# EAGLE design DASH (EAGLE 6.5.0)
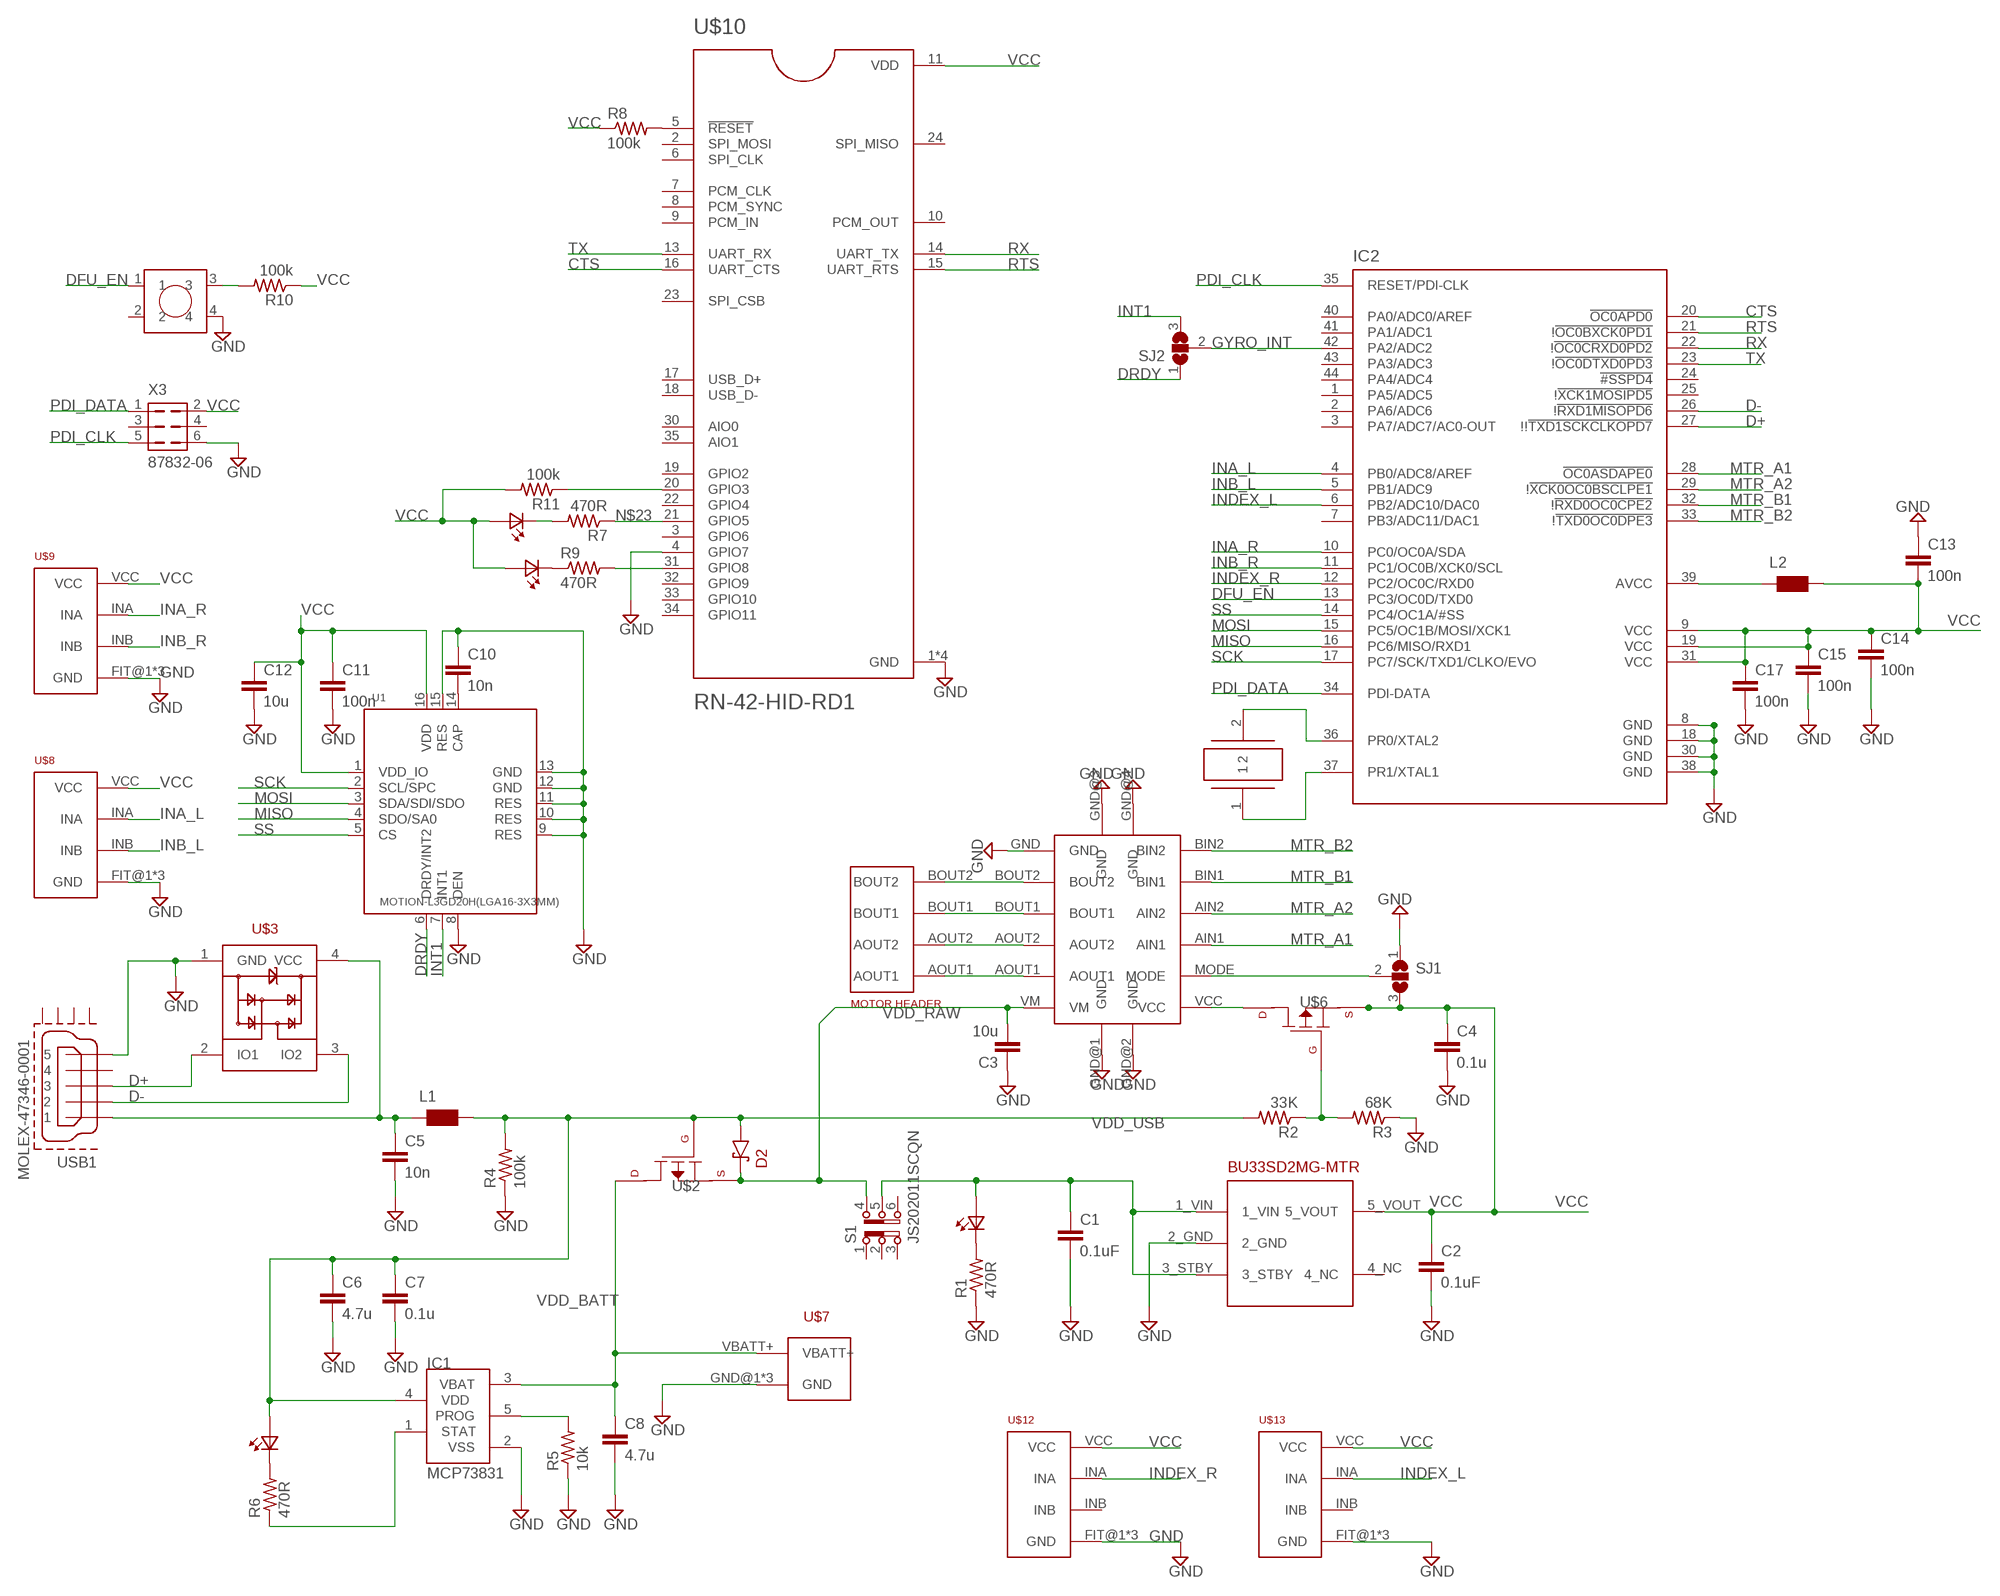
[diagram p0: schematic, sheet 1]

## Parts
C1  0.1uF  0.1UF-25V(+80/-20%)(0603)  [0603-CAP]
C2  0.1uF  0.1UF-25V(+80/-20%)(0603)  [0603-CAP]
C3  10u  C-EUC0805  [C0805]
C4  0.1u  C-EUC0603  [C0603]
C5  10n  C-EUC0603  [C0603]
C6  4.7u  C-EUC0603  [C0603]
C7  0.1u  C-EUC0603  [C0603]
C8  4.7u  C-EUC0603  [C0603]
C10  10n  C-EUC0603  [C0603]
C11  100n  C-EUC0603  [C0603]
C12  10u  C-EUC0805  [C0805]
C13  100n  C-EUC0603  [C0603]
C14  100n  C-EUC0603  [C0603]
C15  100n  C-EUC0603  [C0603]
C17  100n  C-EUC0603  [C0603]
D1  LTST-C190KRKT  [0603]
D2  SCHOTTKY_DIODE_0805  [SCHOTTKY_DIODE_0805]
D3  LTST-C190KRKT  [0603]
D5  LTST-C190KRKT  [0603]
D6  LTST-C190KRKT  [0603]
IC1  MCP73831  [SOT23-5L]
IC2  AT-XMEGA-XXA4-AU  [QFP80P1200X1200X120-44N]
L1  WE-CBF_0603  [0603]
L2  WE-CBF_0603  [0603]
R1  470R  R-US_R0603  [R0603]
R2  33K  R-US_R0603  [R0603]
R3  68K  R-US_R0603  [R0603]
R4  100k  R-US_R0603  [R0603]
R5  10k  R-US_R0603  [R0603]
R6  470R  R-US_R0603  [R0603]
R7  470R  R-US_R0603  [R0603]
R8  100k  R-US_R0603  [R0603]
R9  470R  R-US_R0603  [R0603]
R10  100k  R-US_R0603  [R0603]
R11  100k  R-US_R0603  [R0603]
S1  JS202011SCQN  [JS202011SCQN]
SJ1  SJ2W  [SJ_2]
SJ2  SJ2W  [SJ_2]
U1  MOTION-L3GD20H(LGA16-3X3MM)  [LGA16-0.5-3X3MM]
U$1  LDO_BU33SD2-MSURFACE_MOUNT  [SSOP5]
U$2  P-FETSMD  [SOT-323]
U$3  PRTR5V0U2X  [SOT143B]
U$4  DRV8835  [DRV8835]
U$5  SMB04-SRSS-TBSMD  [SM04B-SRSS-TB]
U$6  P-FETSMD  [SOT-323]
U$7  SM02B-SRSS  [SM02B-SRSS]
U$8  LEFT_ENCODER  [SM04B-SRSS-TB]
U$9  LEFT_ENCODER  [SM04B-SRSS-TB]
U$10  RN-42-HID-RD1  [MICROCHIP_RN-42-HID-RD1]
U$11  PUSHBUTTON  [PUSHBUTTON]
U$12  LEFT_ENCODER  [SM04B-SRSS-TB]
U$13  LEFT_ENCODER  [SM04B-SRSS-TB]
U$14  FC-12M_32.7  [FC-12M_32.7]
USB1  MOLEX-47346-0001  [MOLEX-47364-0001]
X3  87832-06  [87832-06]

## Nets
CTS: IC2.20(!OC0APD0) U$10.16(UART_CTS)
D+: IC2.27(!!!TXD1SCKCLKOPD7) U$3.2(IO1) USB1.3
D-: IC2.26(!!RXD1MISOPD6) U$3.3(IO2) USB1.2
DFU_EN: IC2.13(PC3/OC0D/TXD0) U$11.1
DRDY: SJ2.1 U1.6(DRDY/INT2)
GND: C1.2 C2.2 C3.1 C4.2 C5.2 C6.2 C7.2 C8.2 C10.1 C11.2 C12.2 C13.1 C14.2 C15.2 C17.2 IC1.2(VSS) IC2.8(GND) IC2.18(GND) IC2.30(GND) IC2.38(GND) R1.1 R3.1 R4.1 R5.1 SJ1.1 U1.8(DEN) U1.9(RES) U1.10(RES) U1.11(RES) U1.12(GND) U1.13(GND) U1.15(RES) U$1.2_GND U$3.1(GND) U$4.GND U$4.GND@1(GND) U$4.GND@2(GND) U$4.GND@3(GND) U$4.GND@4(GND) U$7.GND@1(GND) U$7.GND@2(GND) U$7.VBATT-(GND) U$8.FIT@1(GND) U$8.FIT@2(GND) U$8.GND U$9.FIT@1(GND) U$9.FIT@2(GND) U$9.GND U$10.1(GND) U$10.4(GPIO7) U$10.12(GND) U$10.28(GND) U$10.29(GND) U$11.4 U$12.FIT@1(GND) U$12.FIT@2(GND) U$12.GND U$13.FIT@1(GND) U$13.FIT@2(GND) U$13.GND USB1.5 X3.6
GYRO_INT: IC2.42(PA2/ADC2) SJ2.2
INA_L: IC2.4(PB0/ADC8/AREF) U$8.INA
INA_R: IC2.10(PC0/OC0A/SDA) U$9.INA
INB_L: IC2.5(PB1/ADC9) U$8.INB
INB_R: IC2.11(PC1/OC0B/XCK0/SCL) U$9.INB
INDEX_L: IC2.6(PB2/ADC10/DAC0) U$13.INA
INDEX_R: IC2.12(PC2/OC0C/RXD0) U$12.INA
INT1: SJ2.3 U1.7(INT1)
MISO: IC2.16(PC6/MISO/RXD1) U1.4(SDO/SA0)
MOSI: IC2.15(PC5/OC1B/MOSI/XCK1) U1.3(SDA/SDI/SDO)
MTR_A1: IC2.28(!OC0ASDAPE0) U$4.AIN1
MTR_A2: IC2.29(!!XCK0OC0BSCLPE1) U$4.AIN2
MTR_B1: IC2.32(!!RXD0OC0CPE2) U$4.BIN1
MTR_B2: IC2.33(!!TXD0OC0DPE3) U$4.BIN2
N$1: C1.1 D1.2(A2) S1.5 U$1.1_VIN U$1.3_STBY
N$2: D1.1(K2) R1.2
N$3: R10.2 U$11.3
N$4: U$4.AOUT1 U$5.AOUT1
N$5: C10.2 U1.14(CAP)
N$6: U$4.AOUT2 U$5.AOUT2
N$7: U$4.BOUT1 U$5.BOUT1
N$8: U$4.BOUT2 U$5.BOUT2
N$9: U$4.VCC U$6.3_DRAIN
N$10: R2.1 R3.2 U$6.1_GATE
N$11: SJ1.2 U$4.MODE
N$12: C5.1 L1.1 U$3.4(VCC) USB1.1
N$13: D3.1(K2) R6.2
N$14: IC1.5(PROG) R5.2
N$15: IC1.1(STAT) R6.1
N$16: D5.1(K2) R7.2
N$17: D6.1(K2) R9.1
N$18: IC2.36(PR0/XTAL2) U$14.2
N$19: IC2.37(PR1/XTAL1) U$14.1
N$20: IC2.39(AVCC) L2.1
N$21: R9.2 U$10.31(GPIO8)
N$22: R8.2 U$10.5(!RESET)
N$23: R7.1 U$10.21(GPIO5)
N$24: R11.1 U$10.20(GPIO3)
PDI_CLK: IC2.35(RESET/PDI-CLK) X3.5
PDI_DATA: IC2.34(PDI-DATA) X3.1
RTS: IC2.21(!!OC0BXCK0PD1) U$10.15(UART_RTS)
RX: IC2.22(!!OC0CRXD0PD2) U$10.14(UART_TX)
SCK: IC2.17(PC7/SCK/TXD1/CLKO/EVO) U1.2(SCL/SPC)
SS: IC2.14(PC4/OC1A/#SS) U1.5(CS)
TX: IC2.23(!!OC0DTXD0PD3) U$10.13(UART_RX)
VCC: C2.1 C4.1 C11.1 C12.1 C13.2 C14.1 C15.1 C17.1 D5.2(A2) D6.2(A2) IC2.9(VCC) IC2.19(VCC) IC2.31(VCC) L2.2 R8.1 R10.1 R11.2 SJ1.3 U1.1(VDD_IO) U1.16(VDD) U$1.5_VOUT U$6.2_SOURCE U$8.VCC U$9.VCC U$10.11(VDD) U$12.VCC U$13.VCC X3.2
VDD_BATT: C8.1 IC1.3(VBAT) U$2.3_DRAIN U$7.VBATT+
VDD_RAW: C3.2 D2.1_CATHODE S1.4 U$2.2_SOURCE U$4.VM
VDD_USB: C6.1 C7.1 D2.2_ANODE D3.2(A2) IC1.4(VDD) L1.2 R2.2 R4.2 U$2.1_GATE
Unconnected: IC2.1(PA5/ADC5) IC2.2(PA6/ADC6) IC2.3(PA7/ADC7/AC0-OUT) IC2.7(PB3/ADC11/DAC1) IC2.24(!#SSPD4) IC2.25(!!XCK1MOSIPD5) IC2.40(PA0/ADC0/AREF) IC2.41(PA1/ADC1) IC2.43(PA3/ADC3) IC2.44(PA4/ADC4) S1.1 S1.2 S1.3 S1.6 U$1.4_NC U$10.2(SPI_MOSI) U$10.3(GPIO6) U$10.6(SPI_CLK) U$10.7(PCM_CLK) U$10.8(PCM_SYNC) U$10.9(PCM_IN) U$10.10(PCM_OUT) U$10.17(USB_D+) U$10.18(USB_D-) U$10.19(GPIO2) U$10.22(GPIO4) U$10.23(SPI_CSB) U$10.24(SPI_MISO) U$10.30(AIO0) U$10.32(GPIO9) U$10.33(GPIO10) U$10.34(GPIO11) U$10.35(AIO1) U$11.2 U$12.INB U$13.INB USB1.4 USB1.GND1 USB1.GND2 USB1.GND3 USB1.GND4 X3.3 X3.4

## Power pins joined to a net without a drawn wire
GND: U$4.GND@5(GND)

## Library data of the parts
C1 C2 = SparkFun-Capacitors:0.1UF-25V(+80/-20%)(0603): CAP-00810 Ceramic Standard decoupling cap; PROD_ID: CAP-00810
C3-C8 = rcl:C-EU: CAPACITOR, European symbol
C10-C15 C17 = resistor:C-EU: CAPACITOR, European symbol
D1 D3 D5 D6 = LTST-C190KRKT:LTST-C190KRKT: http://octopart.com/ltst-c190krkt-lite-on-549893
D2 = SCHOTTKY_DIODE_0805:SCHOTTKY_DIODE_0805
IC1 = microchip-update-2:MCP73831: Miniature Single-Cell, Fully Integrated Li-Ion, Li-Polymer Charge Management Controllers
IC2 = xmega-a4:AT-XMEGA-XXA4-AU: ATxMega a4 Serie
L1 L2 = wuerth-elektronik:WE-CBF: SMD EMI Suppression Ferrite Beads - excellent anti-EMI properties - low DCR - impedances till 3000 ohms - rated current up to 6 A
R1 R4-R11 = rcl:R-US_: RESISTOR, American symbol
R2 R3 = resistor:R-US_: RESISTOR, American symbol
S1 = switch-ck:JS202011SCQN: DPDT SLIDE SWITCH
SJ1 SJ2 = jumper:SJ2W: SMD solder JUMPER
U1 = MOTION-L3GD20H_LGA16-3X3MM_:MOTION-L3GD20H(LGA16-3X3MM): 314080018
U$1 = LDO_BU33SD2MG-MTR:LDO_BU33SD2-M
U$2 U$6 = P-FET:P-FET: MTM231232LBF Silicon P-channel MOSFET
U$3 = TVS:PRTR5V0U2X
U$4 = DRV8835:DRV8835
U$5 = DRV8835:SMB04-SRSS-TB
U$7 = SM02B-SRSS:SM02B-SRSS
U$8 U$9 U$12 U$13 = Left-encoder-header:LEFT_ENCODER
U$10 = RN-42-HID-RD1:RN-42-HID-RD1: RN-42 Series 3 Mbps 30 mA Class 2 Bluetooth Module
U$11 = Push-button:PUSHBUTTON
U$14 = crystal:FC-12M_32.7
USB1 = usb_con-update:MOLEX-47346-0001: MICRO USB B, BOTTOM MOUNT
X3 = con-molex:87832-06: Milli-Grid Header 2.00mm (.079") Pitch; OC_FARNELL: 1756947; OC_NEWARK: unknown

## Board
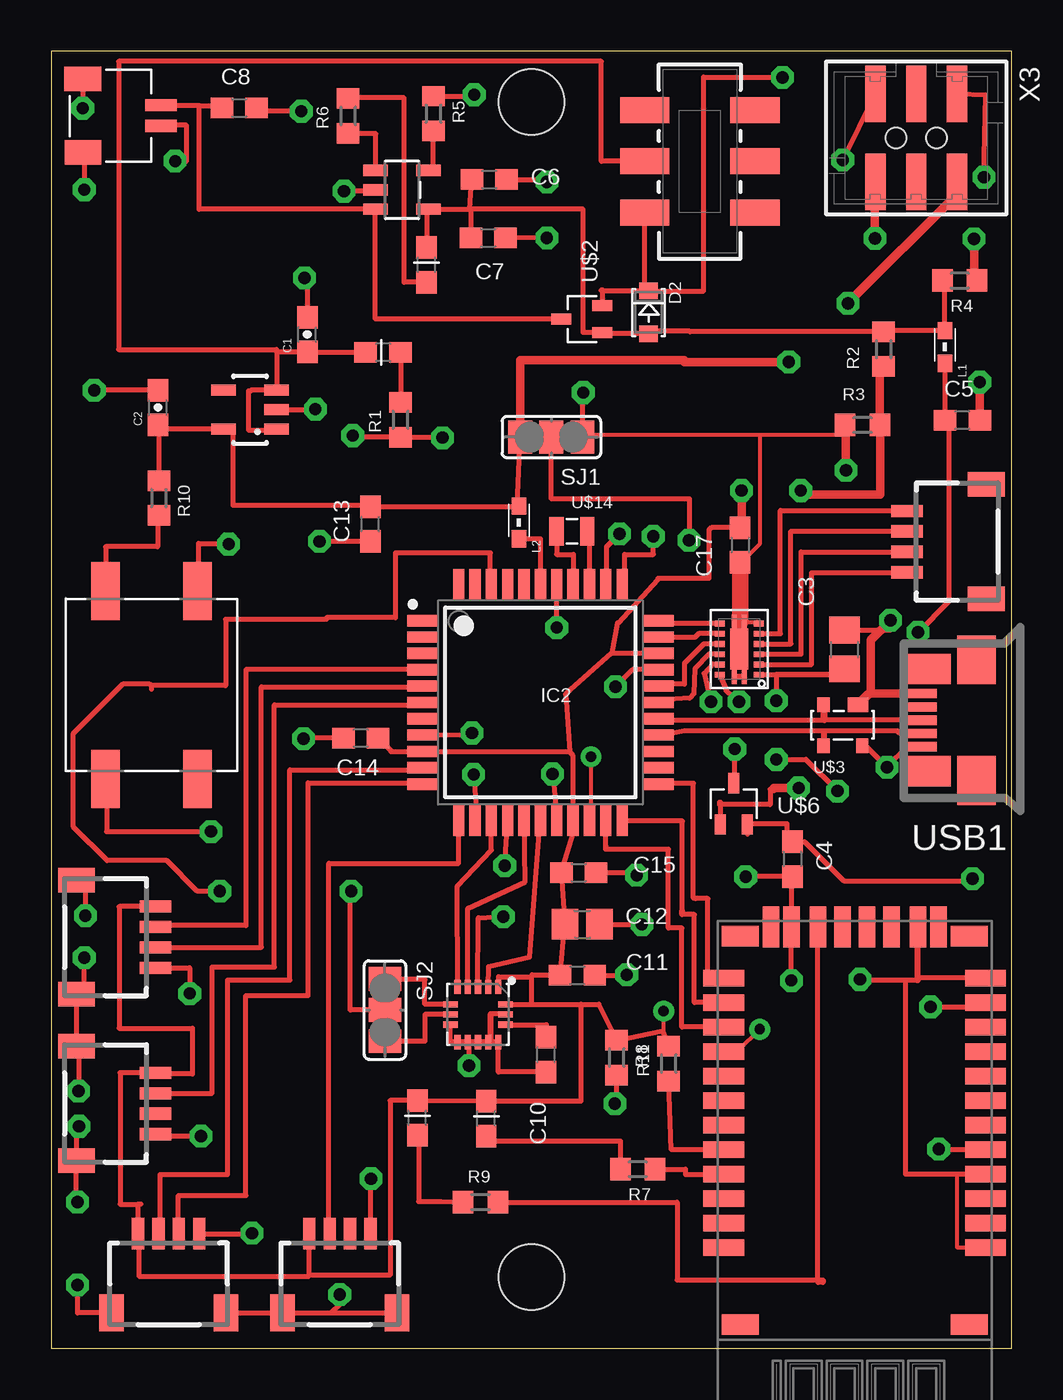
[diagram p1: board, top side]
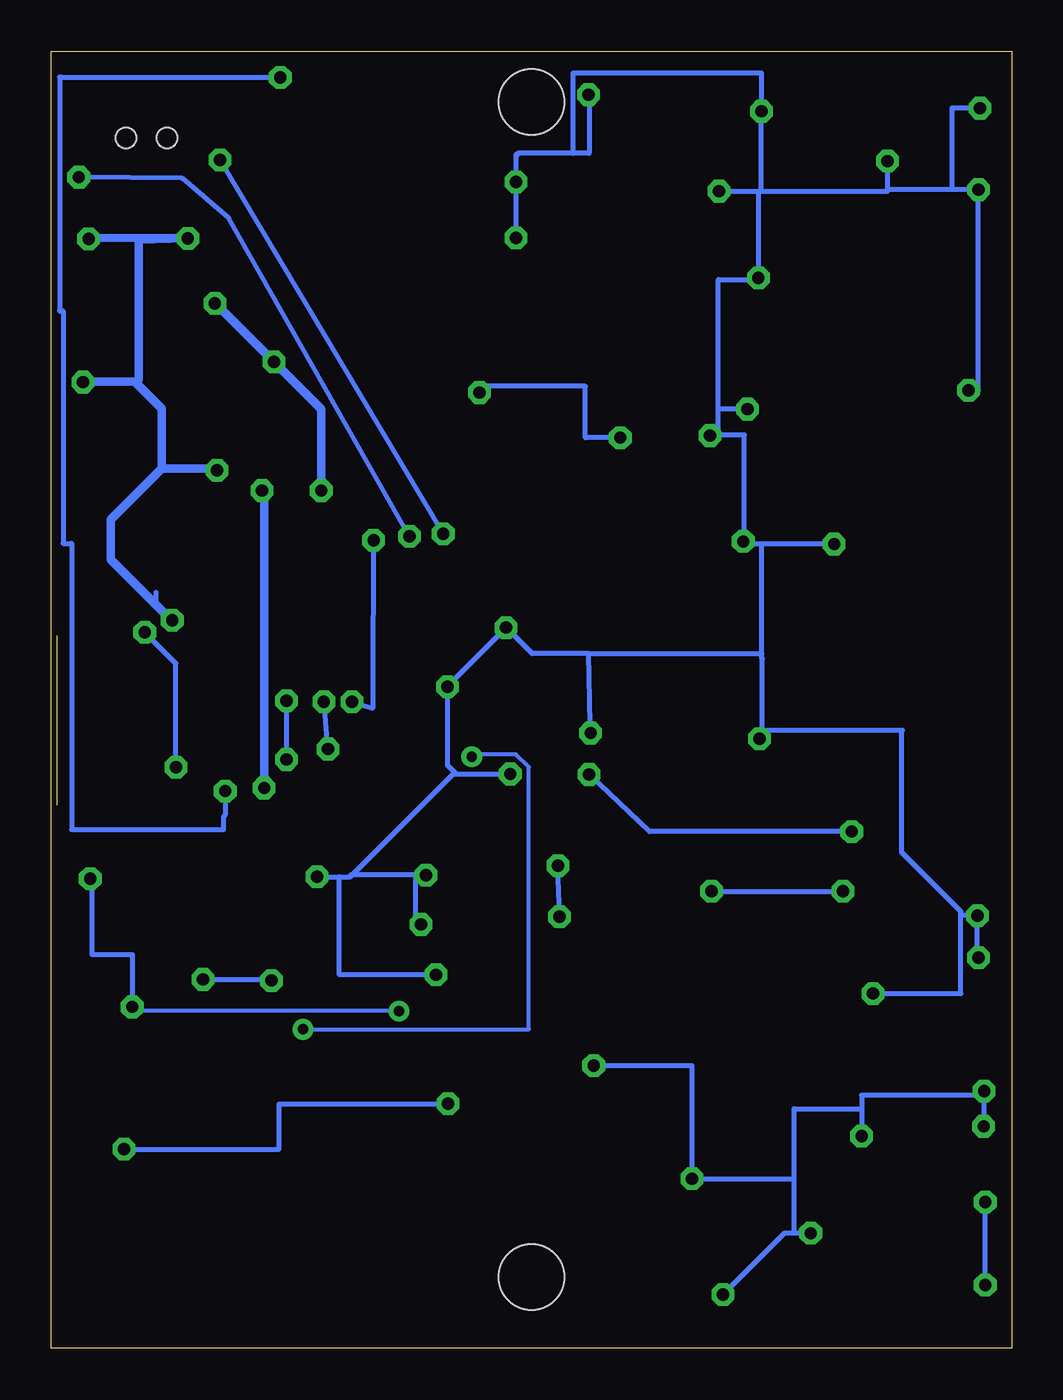
[diagram p2: board, bottom side, seen from below]

Size 47 x 63.5 mm. Coordinates in mm from the lower left corner, seen from the top.
Outline: 0,0 47,0 47,63.5 0,63.5 0,0
Copper layers (1*16): Top 0.035mm / dielectric 1.5mm / Bottom 0.035mm
Design rules "SparkFun": minimum track width 8mil, minimum drill 20mil, track to track 8mil, track to pad 8mil, pad to pad 8mil, via to via 8mil, smd to smd 8mil, copper to edge 10mil, drill to drill 8mil, minimum pad ring 12mil, minimum via ring 10mil, stop-mask expansion 4mil, vias tented up to drill 25mil, thermal gap 10mil
Holes 3.2 mm at 23.5,61 23.5,3.5

### Footprints (pad centres in the part's own frame; a part is rotated, then mirrored left to right if it is on the bottom)
0603-CAP = smd 1.1 x 1: 1 -0.85,0; 2 0.85,0
C0805 = smd 1.3 x 1.5: 1 -0.95,0; 2 0.95,0
C0603 = smd 1.1 x 1: 1 -0.85,0; 2 0.85,0
C0805' = smd 1.3 x 1.5: 1 -0.85,0; 2 0.85,0
0603 = smd 1.1 x 1: 1 -0.85,0; 2 0.85,0
SCHOTTKY_DIODE_0805 = smd 0.8 x 0.9: 1_CATHODE -1.05,0; 2_ANODE 1.05,0
SOT23-5L = smd 0.55 x 1.2: 1 -0.95,-1.3; 2 0,-1.3; 3 0.95,-1.3; 4 0.95,1.3; 5 -0.95,1.3
QFP80P1200X1200X120-44N = smd 1.55 x 0.55: 1 -5.75,4; 2 -5.75,3.2; 3 -5.75,2.4; 4 -5.75,1.6; 5 -5.75,0.8; 6 -5.75,0; 7 -5.75,-0.8; 8 -5.75,-1.6; 9 -5.75,-2.4; 10 -5.75,-3.2; 11 -5.75,-4; 23 5.75,-4; 24 5.75,-3.2; 25 5.75,-2.4; 26 5.75,-1.6; 27 5.75,-0.8; 28 5.75,0; 29 5.75,0.8; 30 5.75,1.6; 31 5.75,2.4; 32 5.75,3.2; 33 5.75,4 | smd 0.55 x 1.55: 12 -4,-5.75; 13 -3.2,-5.75; 14 -2.4,-5.75; 15 -1.6,-5.75; 16 -0.8,-5.75; 17 0,-5.75; 18 0.8,-5.75; 19 1.6,-5.75; 20 2.4,-5.75; 21 3.2,-5.75; 22 4,-5.75; 34 4,5.75; 35 3.2,5.75; 36 2.4,5.75; 37 1.6,5.75; 38 0.8,5.75; 39 0,5.75; 40 -0.8,5.75; 41 -1.6,5.75; 42 -2.4,5.75; 43 -3.2,5.75; 44 -4,5.75
0603' = smd 0.85 x 0.7: 1 -0.9,0; 2 0.7,0
R0603 = smd 1 x 1.1: 1 -0.85,0; 2 0.85,0
JS202011SCQN = smd 1.27 x 2.4: 1 -2.5,-2.7; 2 0,-2.7; 3 2.5,-2.7; 4 -2.5,2.7; 5 0,2.7; 6 2.5,2.7
SJ_2 = smd 1.168 x 1.6: 1 -1.524,0; 2 0,0; 3 1.524,0
LGA16-0.5-3X3MM = smd 0.7 x 0.3: 1 -1.35,1; 2 -1.35,0.5; 3 -1.35,0; 4 -1.35,-0.5; 5 -1.35,-1; 9 1.35,-1; 10 1.35,-0.5; 11 1.35,0; 12 1.35,0.5; 13 1.35,1 | smd 0.3 x 0.7: 6 -0.5,-1.35; 7 0,-1.35; 8 0.5,-1.35; 14 0.5,1.35; 15 0,1.35; 16 -0.5,1.35
SSOP5 = smd 0.55 x 1.2: 1_VIN -0.95,-1.3; 2_GND 0,-1.3; 3_STBY 0.95,-1.3; 4_NC 0.95,1.3; 5_VOUT -0.95,1.3
SOT-323 = smd 0.559 x 0.991: 1_GATE -0.66,-1.003; 2_SOURCE 0.66,-1.003; 3_DRAIN 0,1.003
SOT143B = smd 1 x 0.7: 1 -0.75,-1 | smd 0.6 x 0.7: 2 0.95,-1; 3 0.95,1; 4 -0.95,1
DRV8835 = smd 0.5 x 0.28: AIN1 0.95,0.25; AIN2 0.95,-0.25; AOUT1 -0.95,0.75; AOUT2 -0.95,0.25; BIN1 0.95,-0.75; BIN2 0.95,-1.25; BOUT1 -0.95,-0.25; BOUT2 -0.95,-0.75; GND -0.95,-1.25; MODE 0.95,0.75; VCC 0.95,1.25; VM -0.95,1.25 | smd 0.25 x 0.7: GND@1 -0.25,1.35; GND@2 0.25,1.35; GND@3 -0.25,-1.35; GND@4 0.25,-1.35 | smd 0.9 x 2: GND@5 0,0
SM04B-SRSS-TB = smd 0.6 x 1.55: AOUT1 -1.5,2.975; AOUT2 -0.5,2.975; BOUT1 0.5,2.975; BOUT2 1.5,2.975 | smd 1.2 x 1.8: FIT@1 -2.8,-0.9; FIT@2 2.8,-0.9
SM02B-SRSS = smd 1.2 x 1.8: GND@1 -1.803,-1.856; GND@2 1.794,-1.847 | smd 0.6 x 1.55: VBATT+ -0.505,1.975; VBATT- 0.505,1.975
SM04B-SRSS-TB' = smd 1.2 x 1.8: FIT@1 -2.8,-0.9; FIT@2 2.8,-0.9 | smd 0.6 x 1.55: GND 1.5,2.975; INA -0.5,2.975; INB 0.5,2.975; VCC -1.5,2.975
MICROCHIP_RN-42-HID-RD1 = smd 2 x 0.8: 1 -6.4,3.1; 2 -6.4,1.9; 3 -6.4,0.7; 4 -6.4,-0.5; 5 -6.4,-1.7; 6 -6.4,-2.9; 7 -6.4,-4.1; 8 -6.4,-5.3; 9 -6.4,-6.5; 10 -6.4,-7.7; 11 -6.4,-8.9; 12 -6.4,-10.1; 13 6.4,-10.1; 14 6.4,-8.9; 15 6.4,-7.7; 16 6.4,-6.5; 17 6.4,-5.3; 18 6.4,-4.1; 19 6.4,-2.9; 20 6.4,-1.7; 21 6.4,-0.5; 22 6.4,0.7; 23 6.4,1.9; 24 6.4,3.1 | smd 0.8 x 2: 28 3.1,-12.6; 29 -3.1,-12.6; 30 4.1,-12.6; 31 1.8,-12.6; 32 0.6,-12.6; 33 -0.6,-12.6; 34 -1.8,-12.6; 35 -4.1,-12.6 | smd 1.8 x 1: SHIELD1 -5.6,6.85; SHIELD2 5.6,6.85; SHIELD3 -5.6,-12.15; SHIELD4 5.6,-12.15
PUSHBUTTON = smd 2.825 x 1.4: 1 -4.6,2.25; 2 -4.6,-2.25; 3 4.6,2.25; 4 4.6,-2.25
FC-12M_32.7 = smd 0.7 x 1.4: 1 -0.75,0; 2 0.75,0
MOLEX-47364-0001 = smd 1.7 x 0.45: 1 2.8,1.3; 2 2.8,0.65; 3 2.8,0; 4 2.8,-0.65; 5 2.8,-1.3 | smd 1.9 x 2.375: GND1 0,2.95; GND4 0,-2.95 | smd 2.1 x 1.475: GND2 2.3,2.5; GND3 2.3,-2.5
87832-06 = smd 1 x 2.75: 1 -2,-2.15; 2 -2,2.15; 3 0,-2.15; 4 0,2.15; 5 2,-2.15; 6 2,2.15 | hole 1: -1,0; 1,0

### Placement (x,y rotation side)
C1  12.54,49.63 90 top
C2  5.23,46.05 90 top
C3  38.81,34.21 270 top
C4  36.27,23.95 270 top
C5  44.59,45.44 0 top
C6  21.44,57.21 0 top
C7  21.39,54.35 0 top
C8  9.2,60.71 0 top
C10  24.22,14.38 90 top
C11  25.75,18.26 0 top
C12  10u  [C0805']  25.99,20.76 0 top
C13  15.62,40.35 90 top
C14  15.16,29.88 180 top
C15  25.81,23.29 0 top
C17  33.71,39.33 270 top
D1  16.25,48.75 180 top
D2  29.23,50.71 270 top
D3  18.38,53.04 90 top
D5  21.29,11.25 90 top
D6  17.92,11.29 90 top
IC1  17.17,56.71 270 top
IC2  23.94,31.62 0 top
L1  [0603']  43.73,49.12 90 top
L2  [0603']  22.89,40.53 90 top
R1  17.1,45.45 90 top
R2  40.74,48.91 90 top
R3  39.7,45.2 0 top
R4  44.46,52.26 180 top
R5  18.71,60.44 270 top
R6  14.53,60.32 90 top
R7  28.7,8.77 180 top
R8  27.67,14.23 270 top
R9  21.01,7.16 0 top
R10  5.27,41.63 270 top
R11  30.22,13.94 90 top
S1  31.74,58.1 90 top
SJ1  24.48,44.61 180 top
SJ2  16.33,16.56 270 top
U1  20.89,16.35 270 top
U$1  9.73,45.95 90 top
U$2  25.97,50.38 90 top
U$3  38.74,30.5 180 top
U$4  33.67,34.23 180 top
U$5  44.86,39.49 90 top
U$6  33.4,26.66 0 top
U$7  3.41,60.34 270 top
U$8  LEFT_ENCODER  [SM04B-SRSS-TB']  2.14,20.13 270 top
U$9  LEFT_ENCODER  [SM04B-SRSS-TB']  5.75,2.64 0 top
U$10  39.32,8.03 180 top
U$11  4.92,32.47 90 top
U$12  LEFT_ENCODER  [SM04B-SRSS-TB']  14.13,2.64 0 top
U$13  LEFT_ENCODER  [SM04B-SRSS-TB']  2.14,11.99 270 top
U$14  25.49,40 0 top
USB1  45.28,30.75 180 top
X3  42.33,59.25 180 top

### Tracks (layer width: path | path; a pad name or v marks a point on that pad's centre or on a via)
CTS  (via drill 0.51)
  Top 0.203: v26.42,28.96 26.42,25.91 IC2.20 | v34.67,15.62 33.66,14.61 33.02,14.61 U$10.16
  Bottom 0.203: v26.42,28.96 26.29,29.08 24.26,29.08 23.62,28.45 23.62,15.62 v34.67,15.62
D+
  Top 0.254: USB1.3 37.79,30.75 U$3.2 37.85,31.5 37.85,30.73 29.69,30.73 IC2.27
D-
  Top 0.203: IC2.26 29.72,30.1 29.74,29.98
  Top 0.254: 37.79,30.23 U$3.3 37.85,29.5 37.85,30.23 | USB1.2 41.53,30.1 41.4,30.23 37.85,30.23 | 37.85,30.23 37.79,30.23 | 37.79,30.23 30.99,30.23 29.74,29.98 29.72,29.97
DFU_EN  (via drill 0.6)
  Top 0.254: U$11.1 2.72,27.87 2.72,25.3 v7.82,25.3 | v20.68,28.09 20.83,25.96 IC2.13
  Bottom 0.254: v7.82,25.3 17.73,25.3 v20.68,28.09
DRDY
  Top 0.254: U1.6 18.29,16.85 18.29,18.06 16.33,18.06 SJ2.1
GND  (via drill 0.6)
  Top 0.203: 44.32,8.53 44.32,4.95 45.72,4.95 U$10.1 | 34.67,44.7 38.73,44.7 R3.1 | 34.67,44.7 26.04,44.7 SJ1.1 | U$4.GND 34.54,35.56 34.04,35.56 U$4.GND@3 | 33.84,35.5 33.78,35.56 33.71,35.58 | 34.67,44.7 34.67,39.37 33.78,38.48 C17.2
  Top 0.254: C6.2 24.26,57.21 v24.26,57.1 | v24.26,54.36 22.19,54.33 C7.2 | R5.1 20.7,61.29 v20.7,61.37 | IC1.2 15.87,56.64 v14.33,56.64 | v12.24,60.55 10.05,60.55 C8.2 | v6.07,58.12 6.63,58.12 6.63,59.87 5.38,59.87 U$7.VBATT- | v12.39,52.4 12.54,52.4 C1.2 | U$7.GND@2 1.63,58.55 v1.63,56.72 | U$7.GND@1 v1.55,60.71 | C2.2 v2.11,46.9 v2.11,46.89 | U$1.2_GND 12.93,45.95 v12.93,45.97 | v14.76,44.68 14.76,44.6 R1.1 19.15,44.6 v19.15,44.58 | v26.04,46.79 26,46.79 SJ1.1 | C13.1 v13.13,39.5 | U$11.4 7.21,37.07 7.21,39.4 8.69,39.4 v8.69,39.37 | C14.2 12.34,29.88 v12.34,29.84 | IC2.8 20.55,30.05 v20.6,30.12 | U$8.FIT@1 1.68,22.93 v1.68,21.18 | v1.63,19.13 1.63,17.33 U$8.FIT@2 U$13.FIT@1 1.35,14.79 v1.35,12.6 | U$8.GND 6.78,18.63 v6.78,17.37 | v7.34,10.39 5.12,10.39 U$13.GND | v1.37,10.87 1.24,10.87 U$13.FIT@2 1.24,7.16 v1.29,7.16 | U$9.GND 9.83,5.62 v9.83,5.64 | U$9.FIT@1 1.29,1.74 v1.29,3.1 | U$9.FIT@2 U$12.FIT@1 13.72,1.74 | U$12.GND 15.65,5.62 v15.65,8.31 | 13.72,1.74 U$12.FIT@2 | v14.12,2.64 14.12,2.15 13.72,1.74 | U$4.GND@1 U$4.GND@2 | U$4.GND@2 33.42,33.98 U$4.GND@5 | U$4.GND@2 33.42,35.08 33.84,35.5 U$4.GND@3 | v33.98,23.09 v33.98,23.1 C4.2 36.22,23.1 U$10.28 v36.22,18.01 | v24.54,28.12 24.74,26.05 IC2.18 | v24.74,35.28 IC2.38 | IC2.38 | IC2.30 28.45,33.22 v27.61,32.38 | U$10.12 42.42,18.13 42.42,18.01 U$10.29 42.37,20.63 42.37,18.01 41.81,18.01 | 41.81,18.01 39.57,18.01 v39.57,18.06 | v36.22,18.01 | U$10.4 44.32,8.53 41.81,8.53 41.81,18.01 | C10.1 21.89,13.53 U1.13 | U1.8 19.54,15 U1.9 U1.10 U1.11 U1.12 U1.13 | U1.13 21.49,15 21.49,16.38 21.51,16.38 | U1.15 22.23,16.38 21.51,16.38 | C11.2 28.17,18.26 v28.17,18.29 | C15.2 28.65,23.29 v28.65,23.16
  Top 0.254: C12.2 v28.91,20.76 v28.91,20.75 | 21.51,16.38 21.51,15.01 20.45,15.01 v20.45,13.84 | C3.1 41.07,35.16 v41.07,35.64 | U$4.GND@4 33.71,35.58
  Top 0.406: USB1.5 40.04,32.05 U$3.1 39.49,31.54 39.98,32.03 40.06,32.03 40.11,32.08 40.11,34.67 v41.07,35.64 | v38.89,42.98 38.89,45.16 R3.1 | v45.16,54.3 45.16,52.41 R4.1 | v45.44,47.3 C5.2 | v40.31,54.33 40.31,57.08 X3.6
  Top 0.813: 33.71,35.58 C17.2
  Bottom 0.254: v24.26,54.36 v24.26,57.1 24.26,58.45 24.16,58.45 24.16,58.5 21.46,58.5 | v20.7,61.37 20.68,61.37 20.68,58.5 21.46,58.5 | 21.46,58.5 21.46,62.43 12.24,62.43 v12.24,60.55 12.24,56.64 | v14.33,56.64 12.39,56.64 | 12.24,56.64 6.07,56.64 6.07,56.72 | 6.07,56.72 v6.07,58.12 | 12.24,56.64 12.39,56.64 | 12.39,56.64 v12.39,52.4 12.39,52.32 14.35,52.32 14.35,45.97 | 2.92,56.72 v1.63,56.72 1.63,46.89 v2.11,46.89 | 2.92,56.72 6.07,56.72 | v1.55,60.71 2.92,60.71 2.92,56.72 | v12.93,45.97 14.35,45.97 | 14.35,45.97 14.35,44.68 v14.76,44.68 14.76,44.7 13.08,44.7 13.08,39.5 v13.13,39.5 13.13,39.37 12.22,39.37 | v19.15,44.58 20.85,44.58 20.85,47.09 26.04,47.09 v26.04,46.79 | v8.69,39.37 12.22,39.37 | 12.22,34.01 12.22,33.76 12.19,33.76 12.19,29.84 v12.34,29.84 11.94,30.25 5.33,30.25 5.38,30.2 5.38,24.28 2.49,21.39 2.49,21.18 | 12.22,34.01 12.22,39.37 | v20.6,30.12 20.62,30.53 20.7,34.01 | 20.7,34.01 12.22,34.01 | 2.49,21.18 v1.68,21.18 1.68,19.13 v1.63,19.13 | v6.78,17.37 2.49,17.37 2.49,21.18 | v1.35,12.6 1.35,12.39 1.37,12.39 | 1.37,12.39 7.34,12.39 7.34,11.73 | 7.34,11.73 v7.34,10.39 | 1.37,12.39 v1.37,10.87 | v9.83,5.64 10.64,5.64 | 10.64,5.64 10.64,8.31 | 10.64,8.31 10.64,11.73 7.34,11.73 | v1.29,3.1 v1.29,7.16 | 10.64,8.31 v15.65,8.31 15.65,13.84 v20.45,13.84 | 10.64,5.64 11.12,5.64 v14.12,2.64 | 41.87,37.01 41.87,36.41 | v33.98,23.09 32.89,23.09 | 32.89,23.09 32.36,23.09 | 32.36,23.09 27.33,28.12 27.18,28.12 | 27.18,28.12 v24.54,28.12 | 20.7,34.01 23.47,34.01 v24.74,35.28 27.61,32.41 v27.61,32.38 27.61,28.55 27.18,28.12 | v39.57,18.06 36.22,18.06 v36.22,18.01 | v28.17,18.29 32.89,18.29 32.89,23.09 | v28.65,23.16 29.16,23.16
  Bottom 0.254: 29.16,23.16 32.36,23.16 32.36,23.09 | v28.91,20.75 29.16,20.75 29.16,23.16
  Bottom 0.406: v41.07,35.64 41.1,35.64 41.87,36.41 44.07,38.61 44.07,40.56 41.58,43.05 | 41.58,43.05 38.96,43.05 v38.89,42.98 | 41.58,43.05 41.58,46 42.9,47.32 | 42.9,47.32 42.82,47.32 42.72,47.42 42.72,54.28 v40.31,54.33 45.11,54.36 v45.16,54.3 | 42.9,47.32 45.41,47.32 v45.44,47.3
GYRO_INT  (via drill 0.6)
  Top 0.254: IC2.42 21.49,37.37 21.49,38.94 16.84,38.94 16.84,35.76 13.49,35.76 13.49,35.69 8.53,35.69 8.53,32.44 4.9,32.44 | 4.9,32.44 4.9,32.26 | SJ2.2 14.65,16.56 14.63,16.59 14.63,22.33 v14.68,22.38 | v8.26,22.38 7.16,22.38 5.66,23.88 2.74,23.88 1.09,25.53 1.09,30.1 3.53,32.54 4.8,32.54 4.9,32.44
  Bottom 0.254: v14.68,22.38 v8.26,22.38
INA_L
  Top 0.254: IC2.4 9.53,33.22 9.53,20.7 5.12,20.7 U$8.INA
INA_R
  Top 0.254: U$9.INA 5.33,5.62 5.33,8.51 8.64,8.51 8.64,18.03 11.68,18.03 11.68,28.32 18.19,28.32 IC2.10
INB_L
  Top 0.254: U$8.INB 10.29,19.63 10.29,32.38 18.19,32.38 IC2.5
INB_R
  Top 0.254: U$9.INB 6.22,5.62 6.22,7.49 9.53,7.49 9.53,17.27 12.57,17.27 12.57,27.69 18.19,27.69 IC2.11
INDEX_L
  Top 0.254: U$13.INA 7.87,12.49 7.87,18.67 10.92,18.67 10.92,31.5 18.19,31.5 IC2.6
INDEX_R
  Top 0.254: U$12.INA 13.59,5.62 13.59,23.75 19.94,23.75 IC2.12
INT1
  Top 0.254: U1.7 18.29,16.35 18.29,15.04 SJ2.3
MISO
  Top 0.254: U1.4 20.4,21.54 23.19,22.84 IC2.16
MOSI  (via drill 0.6)
  Top 0.254: U1.3 20.9,21.08 v22.12,21.13 | v22.2,23.62 IC2.15
  Bottom 0.254: v22.12,21.13 v22.2,23.62
MTR_A1
  Top 0.254: U$4.AIN1 32.18,33.98 31.5,33.27 31.45,32.05 31.24,31.83 29.82,31.75 IC2.28
MTR_A2
  Top 0.254: U$4.AIN2 31.94,34.48 30.99,33.53 30.99,32.51 29.78,32.51 IC2.29
MTR_B1
  Top 0.203: 30.23,34.8 29.72,34.8 IC2.32
  Top 0.254: U$4.BIN1 31.68,34.98 31.5,34.8 30.23,34.8
MTR_B2
  Top 0.254: U$4.BIN2 29.83,35.48 IC2.33
N$1
  Top 0.254: S1.5 26.92,58.1 26.92,62.99 3.3,62.99 3.3,48.9 11.03,48.9 11.03,48.78 | 11.03,48.78 U$1.3_STBY 9.78,46.9 9.78,46.86 9.65,46.86 9.65,44.96 11.03,44.96 U$1.1_VIN | D1.2 15.27,48.78 C1.1 11.03,48.78
N$2
  Top 0.254: D1.1 R1.2
N$3
  Top 0.254: R10.2 5.21,40.78 5.21,39.24 2.67,39.24 U$11.3
N$4
  Top 0.254: U$4.AOUT1 37.21,33.48 37.21,37.97 41.88,37.97 U$5.AOUT1
N$5
  Top 0.254: U1.14 24.23,15.85 24.22,15.85 C10.2
N$6
  Top 0.254: U$4.AOUT2 36.7,33.98 36.7,38.99 U$5.AOUT2
N$7
  Top 0.254: U$4.BOUT1 36.2,34.48 36.2,40.01 41.88,40.01 U$5.BOUT1
N$8
  Top 0.254: U$4.BOUT2 35.69,34.98 35.69,41.02 41.88,41.02 U$5.BOUT2
N$9  (via drill 0.6)
  Top 0.254: U$4.VCC 33.02,32.2 v33.66,31.65 | v33.45,29.34 U$6.3_DRAIN
  Bottom 0.254: v33.66,31.65 33.48,29.41 33.48,29.31 | 33.48,29.26 33.48,29.31 | 33.48,29.31 v33.45,29.34
N$10  (via drill 0.6)
  Top 0.254: 35.36,27.38 35.18,27.38 35.18,26.62 32.72,26.62 32.72,26.75 32.74,26.75 U$6.1_GATE
  Top 0.406: R2.1 40.55,47.87 R3.2 40.56,45.2 40.56,41.78 36.68,41.78 v36.68,41.99 | v36.58,27.43 35.36,27.43 35.36,27.38
  Bottom 0.406: v36.68,41.99 36.58,41.99 v36.58,27.43
N$11  (via drill 0.6)
  Top 0.254: U$4.MODE 32.36,33.51 31.95,33.05 v32.28,31.65 | v31.22,39.55 31.24,39.55 31.24,41.58 24.48,41.58 SJ1.2
  Bottom 0.254: v32.28,31.65 31.29,31.34 31.24,31.39 31.24,32.21 v31.22,39.55
N$12  (via drill 0.6)
  Top 0.254: USB1.1 41.9,29.45 v40.89,28.45 39.84,29.5 U$3.4 | L1.1 C5.1 43.94,45.23 43.94,36.58 v42.42,35.05
  Bottom 0.254: v40.89,28.45 40.89,33.53 v42.42,35.05
N$13
  Top 0.254: D3.1 17.27,52.19 17.27,61.21 14.53,61.21 R6.2
N$14
  Top 0.254: IC1.5 18.71,57.66 R5.2
N$15
  Top 0.254: R6.1 15.88,59.47 15.88,59.44 15.87,59.44 IC1.1
N$16
  Top 0.254: D5.1 21.51,10.4 21.51,10.16 27.85,10.16 R7.2
N$17
  Top 0.254: D6.1 17.98,10.44 17.98,7.19 19.07,7.19 R9.1
N$18
  Top 0.254: U$14.2 26.34,40 IC2.36
N$19
  Top 0.254: U$14.1 24.74,38.86 25.55,38.86 25.55,38.84 25.54,38.84 IC2.37
N$20
  Top 0.254: L2.1 23.94,39.63 IC2.39
N$21
  Top 0.254: R9.2 30.63,7.16 30.63,3.35 37.77,3.35 37.77,3.23 37.52,3.23 U$10.31
N$22  (via drill 0.6)
  Top 0.254: U$10.5 43.43,9.73 v43.43,9.75 | v27.58,11.99 27.67,11.99 R8.2
  Bottom 0.254: v43.43,9.75 35.84,9.75 35.84,11.96 27.58,11.96 v27.58,11.99
N$23
  Top 0.254: R7.1 31.04,8.77 31.04,8.51 32.92,8.51 U$10.21
N$24
  Top 0.254: U$10.20 30.34,9.73 R11.1
PDI_CLK  (via drill 0.6)
  Top 0.254: IC2.35 27.18,37.37 27.18,39.24 v27.81,39.88 | v38.73,58.17 X3.5
  Bottom 0.254: v27.81,39.88 v38.73,58.17
PDI_DATA  (via drill 0.6)
  Top 0.254: IC2.34 28.07,37.37 28.07,38.86 29.46,38.86 v29.46,39.75 | v45.64,57.33 45.72,61.34 X3.1
  Bottom 0.254: v29.46,39.75 38.3,55.32 40.59,57.28 v45.64,57.33
RTS
  Top 0.254: U$10.15 30.86,15.73 30.86,20.57 30.2,20.57 30.2,24.43 27.13,24.43 27.13,24.59 27.14,24.59 IC2.21
RX
  Top 0.254: U$10.14 31.47,16.93 31.47,21.23 30.86,21.23 30.86,21.44 30.89,21.44 30.89,25.81 27.94,25.81 IC2.22
SCK
  Top 0.254: U1.2 21.41,18.69 23.42,19.15 IC2.17
SS
  Top 0.254: U1.5 19.86,22.61 21.54,24.38 IC2.14
TX
  Top 0.254: U$10.13 32.13,18.13 32.13,22.02 31.52,22.02 31.52,22.05 31.42,22.05 31.42,27.66 29.69,27.66 IC2.23
VCC  (via drill 0.51, 0.6)
  Top 0.203: v29.97,16.51 29.97,15.62 29.91,15.54
  Top 0.254: 5.27,45 U$1.5_VOUT 8.89,45 8.89,41.27 15.62,41.27 C13.2 22.89,41.2 L2.2 22.8,41.23 SJ1.3 | C2.1 5.23,45 5.27,45 | 5.27,45 R10.1 | C14.1 16.64,29.24 16.64,29.21 IC2.9 18.23,29.18 25.38,29.18 | U1.16 23.44,16.84 23.52,16.84 | 23.52,16.84 23.52,18.19 | 23.52,18.19 23.52,18.29 24.9,18.29 C11.1 C12.1 C15.1 25.55,25.2 IC2.19 25.54,29.02 25.38,29.18 | U1.1 21.89,18.19 23.52,18.19 | 23.52,16.84 25.93,16.84 | 25.93,16.84 26.8,16.84 R8.1 29.91,15.54 R11.2 | U$8.VCC 3.33,21.63 3.33,15.67 6.91,15.67 6.91,13.44 5.12,13.44 U$13.VCC 3.38,13.49 3.38,7.06 4.25,7.06 | 4.39,7.06 4.25,7.06 | 4.25,7.06 U$9.VCC 4.29,5.62 4.29,3.53 12.62,3.53 12.62,3.58 | 12.62,3.58 12.62,3.66 12.63,3.66 U$12.VCC | 20.99,12.12 D6.2 16.59,12.14 16.59,3.58 12.62,3.58 | 20.99,12.12 D5.2 | 20.99,12.12 25.93,12.12 25.93,16.84 | C17.1 32.3,40.17 32.18,40.06 32.18,37.69 29.69,37.69 29.69,37.64 27.76,35.51 27.71,35.51 27.43,34.04 | 27.43,34.04 29.69,34.04 IC2.31 | v45.09,22.99 44.98,22.89 38.79,22.89 36.87,24.8 C4.1 36.02,24.8 36.02,25.68 34.06,25.68 U$6.2_SOURCE 34.06,25.17 | v43.03,16.71 45.72,16.71 U$10.11 | 27.43,34.04 25.17,32.03 25.38,29.18
  Top 0.406: X3.2 44.33,56.5 v38.99,51.16 | v36.09,48.28 30.99,48.28 30.99,48.36 22.95,48.36 SJ1.3 | C17.1 33.78,40.17 v33.78,41.99
  Bottom 0.203: v29.97,16.51 42.8,16.51 42.93,16.64 v43.03,16.71
  Bottom 0.254: v45.09,22.99 45.01,22.99 45.01,19.28 43.03,19.28 v43.03,16.71
  Bottom 0.406: v38.99,51.16 38.96,51.16 v36.09,48.28 33.78,45.97 v33.78,41.99
VDD_BATT
  Top 0.254: U$2.3_DRAIN 15.87,50.38 IC1.3 7.24,55.76 7.24,60.83 | 7.24,60.83 5.38,60.83 U$7.VBATT+ | 7.24,60.83 8.35,60.83 C8.1
VDD_RAW  (via drill 0.6)
  Top 0.254: U$4.VM 38.81,32.98 C3.2 38.68,33.26 38.68,32.99 35.48,32.99 v35.48,31.7 | D2.1_CATHODE 29.04,51.76 S1.4 | D2.1_CATHODE 26.92,51.76 26.92,51.82 26.97,51.82 U$2.2_SOURCE | D2.1_CATHODE 31.93,51.76 31.93,62.23 35.79,62.23 v35.79,62.2 | v35.48,28.83 36.93,28.83 v38.48,27.28
  Bottom 0.254: v35.79,62.2 46.48,62.2 46.48,62.23 46.58,62.23 46.58,50.77 46.41,50.77 46.41,39.4 46,39.4 46,25.4 38.56,25.4 38.56,26.04 38.48,26.11 v38.48,27.28 | v35.48,31.7 v35.48,28.83
VDD_USB
  Top 0.254: R4.2 43.73,52.15 L1.2 40.8,49.82 R2.2 31.27,49.76 31.24,49.78 29.36,49.78 D2.2_ANODE 27.04,49.66 U$2.1_GATE 26.04,49.72 26.04,55.75 20.54,55.75 | IC1.4 | IC1.4 20.49,55.75 | 20.49,55.75 C6.1 | 20.49,55.75 20.54,55.75 | 20.54,55.75 C7.1 | IC1.4 18.38,55.75 D3.2